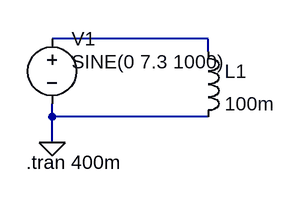
[diagram p0: schematic Lab2_ind.asc]
Lab2_ind.asc, the LTspice schematic file:
Version 4
SHEET 1 880 680
WIRE 256 128 64 128
WIRE 256 144 256 128
WIRE 64 224 64 208
WIRE 256 224 64 224
WIRE 64 256 64 224
FLAG 64 256 0
SYMBOL ind 240 128 R0
SYMATTR InstName L1
SYMATTR Value 100m
SYMATTR SpiceLine Ipk=99m Rser=61.662 Rpar=9.42Meg Cpar=0 mfg="Coilcraft" pn="PCH-45X-107"
SYMBOL voltage 64 112 R0
WINDOW 123 24 72 Left 2
WINDOW 39 0 0 Left 0
WINDOW 3 24 44 Left 2
SYMATTR Value SINE(0 7.3 1000)
SYMATTR InstName V1
TEXT 32 280 Left 2 !.tran 400m

The netlist it stands for:
* Lab2_ind.asc
L1 N001 0 100m Ipk=99m Rser=61.662 Rpar=9.42Meg Cpar=0 mfg="Coilcraft" pn="PCH-45X-107"
V1 N001 0 SINE(0 7.3 1000)
.tran 400m
.backanno
.end